# Altium schematic sheet stF6.SchDoc
size A
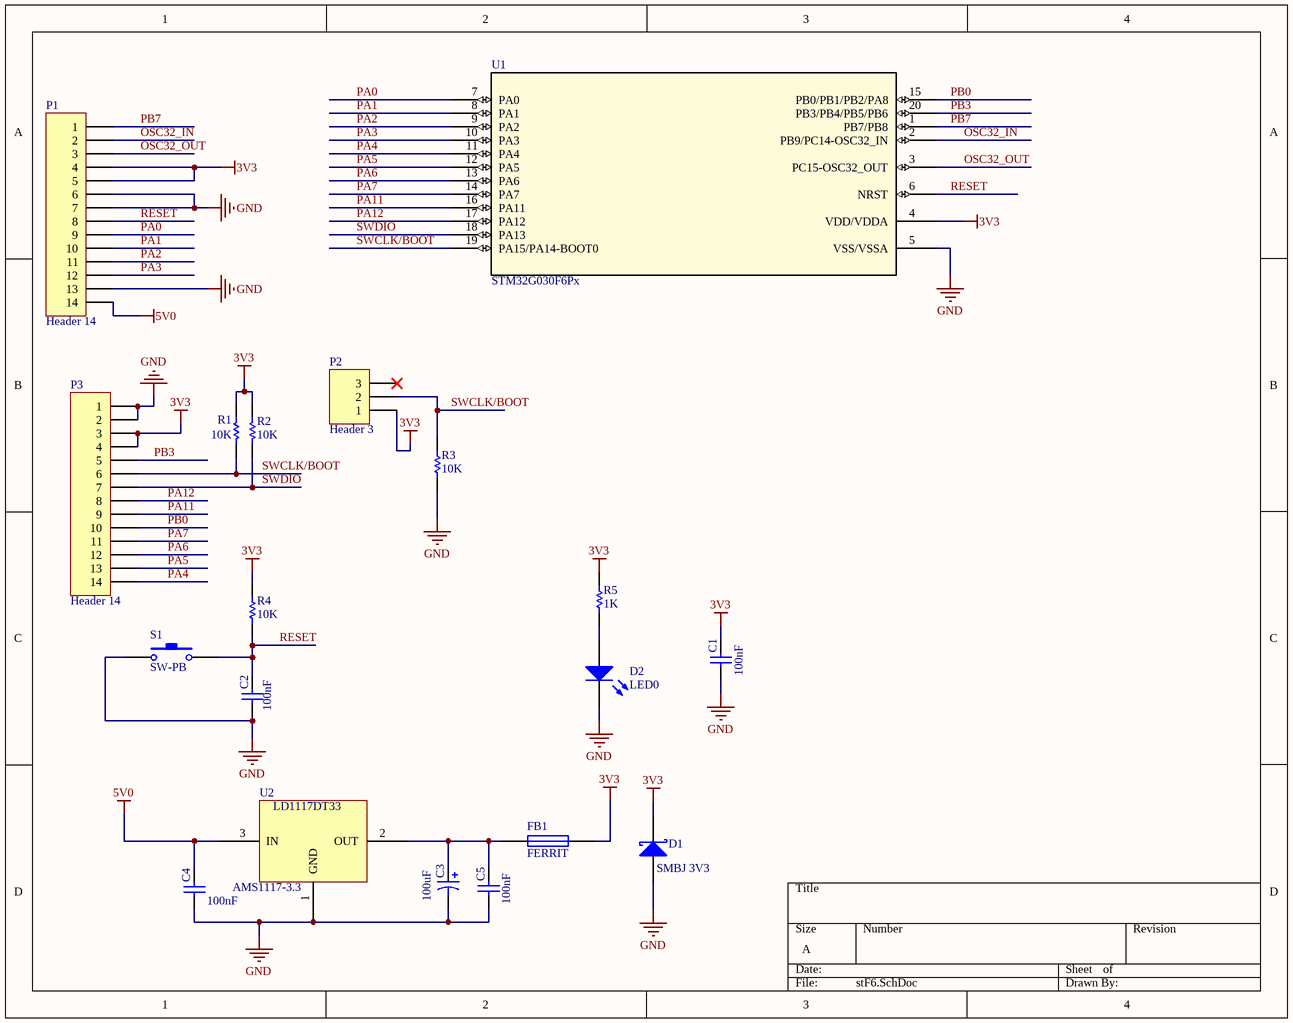
[diagram p0: stF6.SchDoc]

## Parts
C1  100nF  [SMD_805]
C2  100nF  [SMD_805]
C3  100uF  [CAP_SMD_D]
C4  100nF  [SMD_805]
C5  100nF  [SMD_805]
D1  SMBJ 3V3  [tvs]
D2  LED0  [SMD_805]
FB1  FERRIT  [SMD_805]
P1  Header 14  [HDR1X14]
P2  Header 3  [HDR1X3]
P3  Header 14  [HDR1X14]
R1  10K  [SMD_805]
R2  10K  [SMD_805]
R3  10K  [SMD_805]
R4  10K  [SMD_805]
R5  1K  [SMD_805]
S1  SW-PB  [smd_button]
U1  STM32G030F6Px  [TSSOP20]
U2  AMS1117-3.3  [SOT223]

## Nets
3V3: C1.2 D1.2(K) FB1.1 P1.4 P1.5 P2.1 P3.3 P3.4 R1.2 R2.2 R4.2 R5.2 U1.4(VDD/VDDA)
5V0: C4.2 P1.14 U2.3(IN)
GND: C1.1 C2.1 C3.2 C4.1 C5.1 D1.1(A) D2.2(K) P1.6 P1.7 P1.13 P3.1 P3.2 R3.1 S1.1 U1.5(VSS/VSSA) U2.1(GND)
OSC32_IN: P1.2 U1.2(PB9/PC14-OSC32_IN)
OSC32_OUT: P1.3 U1.3(PC15-OSC32_OUT)
PA0: P1.9 U1.7(PA0)
PA1: P1.10 U1.8(PA1)
PA2: P1.11 U1.9(PA2)
PA3: P1.12 U1.10(PA3)
PA4: P3.14 U1.11(PA4)
PA5: P3.13 U1.12(PA5)
PA6: P3.12 U1.13(PA6)
PA7: P3.11 U1.14(PA7)
PA11: P3.9 U1.16(PA11)
PA12: P3.8 U1.17(PA12)
PB0: P3.10 U1.15(PB0/PB1/PB2/PA8)
PB3: P3.5 U1.20(PB3/PB4/PB5/PB6)
PB7: P1.1 U1.1(PB7/PB8)
RESET: C2.2 P1.8 R4.1 S1.2 U1.6(NRST)
SWCLK/BOOT: P2.2 P3.6 R1.1 R3.2 U1.19(PA15/PA14-BOOT0)
SWDIO: P3.7 R2.1 U1.18(PA13)
NetC3_1: C3.1 C5.2 FB1.2 U2.2(OUT)
NetD2_1: D2.1(A) R5.1

Not connected (* = marked no-connect by the designer): P2 3*

## Library data of the parts
C1 C2 C4 C5 = Cap: Capacitor; Published: 8-Jun-2000; LatestRevisionDate: 17-Jul-2002; LatestRevisionNote: Re-released for DXP Platform.; PackageReference: RAD-0.3; Publisher: Altium Limited; Value: 100nF
C3 = Cap Pol1: Polarized Capacitor (Radial); Published: 8-Jun-2000; LatestRevisionDate: 17-Jul-2002; LatestRevisionNote: Re-released for DXP Platform.; PackageReference: RB7.6-15; Publisher: Altium Limited; Value: 100uF
D1 = Diode 11DQ03: Schottky Rectifier; Published: 8-Jun-2000; LatestRevisionDate: 17-Jul-2002; LatestRevisionNote: Re-released for DXP Platform.; DatasheetVersion: Dec-1997; PackageReference: DO-204AL; Publisher: Altium Limited; Code_JEDEC: DO-204-AL; ComponentLink1Description: Manufacturer Link; ComponentLink1URL: http://www.irf.com/; ComponentLink2Description: Datasheet; ComponentLink2URL: http://www.irf.com/product-info/datasheets/data/11dq03.pdf
D2 = LED0: Typical INFRARED GaAs LED; Published: 8-Jun-2000; LatestRevisionDate: 08-Jul-2005; LatestRevisionNote: Mech Layer 1 removed.; PackageReference: LED-0; Publisher: Altium Limited
FB1 = Fuse 1: Fuse; Published: 8-Jun-2000; LatestRevisionDate: 17-Jul-2002; LatestRevisionNote: Re-released for DXP Platform.; PackageReference: PIN-W2/E2.8; Publisher: Altium Limited
P1 P3 = Header 14: Header, 14-Pin; LatestRevisionDate: 17-Jul-2002; LatestRevisionNote: Re-released for DXP Platform.; Publisher: Altium Limited
P2 = Header 3: Header, 3-Pin; LatestRevisionDate: 17-Jul-2002; LatestRevisionNote: Re-released for DXP Platform.; Publisher: Altium Limited
R1-R3 R5 = Res1: Resistor; Published: 8-Jun-2000; LatestRevisionDate: 17-Jul-2002; LatestRevisionNote: Re-released for DXP Platform.; PackageReference: AXIAL-0.3; Publisher: Altium Limited
  R1-R3: Value: 10K
  R5: Value: 1K
R4 = Res1: Resistor; Value: 1K; Published: 8-Jun-2000; LatestRevisionDate: 17-Jul-2002; LatestRevisionNote: Re-released for DXP Platform.; PackageReference: AXIAL-0.3; Publisher: Altium Limited
S1 = SW-PB: Switch; Published: 24-Mar-1999; LatestRevisionDate: 17-Jul-2002; LatestRevisionNote: Re-released for DXP Platform.; PackageReference: SPST-2; Publisher: Altium Limited; PackageDescription: Switch; 2 Leads
U1 = STM32G030F6Px: The STM32G030x6/x8 mainstream microcontrollers are based on high-performance Arm® Cortex®-M0+ 32-bit RISC core operating at up to 64 MHz frequency. / 32K Flash and 8K RAM with 20pin TSSOP 6.4x4.4mm package; Manufacturer_Part_Number: stm32g0_tssop20_t1; Vendor: STMicroelectronics; Copyright: Copyright (C) 2018 Accelerated Designs. All rights reserved; RefDes: RefDes; Type: DEV; Value: Value
U2 = LD1117DT33